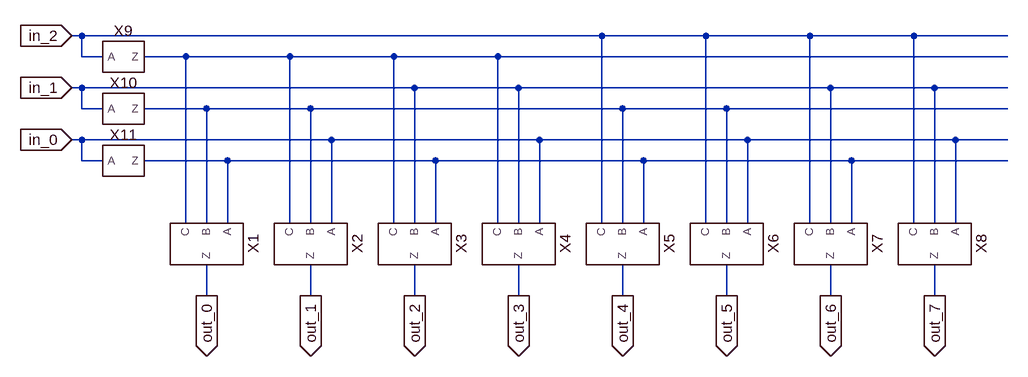
[diagram p0: schematic decoder38.asc]
decoder38.asc, the LTspice schematic file:
Version 4
SHEET 1 1444 680
WIRE 16 -64 0 -64
WIRE 816 -64 16 -64
WIRE 976 -64 816 -64
WIRE 1136 -64 976 -64
WIRE 1296 -64 1136 -64
WIRE 1440 -64 1296 -64
WIRE 16 -32 16 -64
WIRE 48 -32 16 -32
WIRE 176 -32 112 -32
WIRE 336 -32 176 -32
WIRE 496 -32 336 -32
WIRE 656 -32 496 -32
WIRE 1440 -32 656 -32
WIRE 16 16 0 16
WIRE 528 16 16 16
WIRE 688 16 528 16
WIRE 1168 16 688 16
WIRE 1328 16 1168 16
WIRE 1440 16 1328 16
WIRE 16 48 16 16
WIRE 48 48 16 48
WIRE 208 48 112 48
WIRE 368 48 208 48
WIRE 848 48 368 48
WIRE 1008 48 848 48
WIRE 1440 48 1008 48
WIRE 16 96 0 96
WIRE 400 96 16 96
WIRE 720 96 400 96
WIRE 1040 96 720 96
WIRE 1360 96 1040 96
WIRE 1440 96 1360 96
WIRE 16 128 16 96
WIRE 48 128 16 128
WIRE 240 128 112 128
WIRE 560 128 240 128
WIRE 880 128 560 128
WIRE 1200 128 880 128
WIRE 1440 128 1200 128
WIRE 176 224 176 -32
WIRE 208 224 208 48
WIRE 240 224 240 128
WIRE 336 224 336 -32
WIRE 368 224 368 48
WIRE 400 224 400 96
WIRE 496 224 496 -32
WIRE 528 224 528 16
WIRE 560 224 560 128
WIRE 656 224 656 -32
WIRE 688 224 688 16
WIRE 720 224 720 96
WIRE 816 224 816 -64
WIRE 848 224 848 48
WIRE 880 224 880 128
WIRE 976 224 976 -64
WIRE 1008 224 1008 48
WIRE 1040 224 1040 96
WIRE 1136 224 1136 -64
WIRE 1168 224 1168 16
WIRE 1200 224 1200 128
WIRE 1296 224 1296 -64
WIRE 1328 224 1328 16
WIRE 1360 224 1360 96
WIRE 208 336 208 288
WIRE 368 336 368 288
WIRE 528 336 528 288
WIRE 688 336 688 288
WIRE 848 336 848 288
WIRE 1008 336 1008 288
WIRE 1168 336 1168 288
WIRE 1328 336 1328 288
FLAG 0 96 in_0
IOPIN 0 96 In
FLAG 0 16 in_1
IOPIN 0 16 In
FLAG 0 -64 in_2
IOPIN 0 -64 In
FLAG 208 336 out_0
IOPIN 208 336 Out
FLAG 368 336 out_1
IOPIN 368 336 Out
FLAG 528 336 out_2
IOPIN 528 336 Out
FLAG 688 336 out_3
IOPIN 688 336 Out
FLAG 848 336 out_4
IOPIN 848 336 Out
FLAG 1008 336 out_5
IOPIN 1008 336 Out
FLAG 1168 336 out_6
IOPIN 1168 336 Out
FLAG 1328 336 out_7
IOPIN 1328 336 Out
SYMBOL and3 208 256 R90
SYMATTR InstName X1
SYMBOL and3 368 256 R90
SYMATTR InstName X2
SYMBOL and3 528 256 R90
SYMATTR InstName X3
SYMBOL and3 688 256 R90
SYMATTR InstName X4
SYMBOL and3 848 256 R90
SYMATTR InstName X5
SYMBOL and3 1008 256 R90
SYMATTR InstName X6
SYMBOL and3 1168 256 R90
SYMATTR InstName X7
SYMBOL and3 1328 256 R90
SYMATTR InstName X8
SYMBOL inv 80 -32 R0
SYMATTR InstName X9
SYMBOL inv 80 48 R0
SYMATTR InstName X10
SYMBOL inv 80 128 R0
SYMATTR InstName X11

The netlist it stands for:
* decoder38.asc
XX1 N003 N002 N001 out_0 and3  ; pins A B C Z
XX2 in_0 N002 N001 out_1 and3  ; pins A B C Z
XX3 N003 in_1 N001 out_2 and3  ; pins A B C Z
XX4 in_0 in_1 N001 out_3 and3  ; pins A B C Z
XX5 N003 N002 in_2 out_4 and3  ; pins A B C Z
XX6 in_0 N002 in_2 out_5 and3  ; pins A B C Z
XX7 N003 in_1 in_2 out_6 and3  ; pins A B C Z
XX8 in_0 in_1 in_2 out_7 and3  ; pins A B C Z
XX9 in_2 N001 inv  ; pins A Z
XX10 in_1 N002 inv  ; pins A Z
XX11 in_0 N003 inv  ; pins A Z
.backanno
.end